# Altium schematic sheet Bluepill.SchDoc
size A4; SheetNumber: 3; SheetTotal: 7
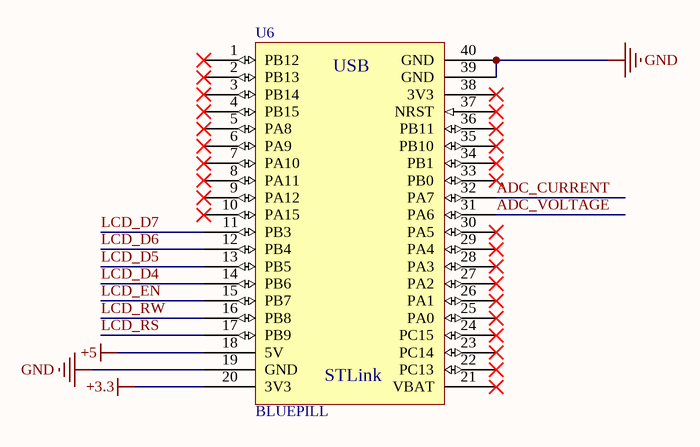
[diagram p0: Bluepill.SchDoc]

## Parts
U6  BLUEPILL  [BLUEPILL]

## Nets
+3.3: U6.20(3V3)
+5: U6.18(5V)
GND: U6.19(GND) U6.39(GND) U6.40(GND)
ADC_CURRENT: U6.32(PA7)
ADC_VOLTAGE: U6.31(PA6)
LCD_D4: U6.14(PB6)
LCD_D5: U6.13(PB5)
LCD_D6: U6.12(PB4)
LCD_D7: U6.11(PB3)
LCD_EN: U6.15(PB7)
LCD_RS: U6.17(PB9)
LCD_RW: U6.16(PB8)

Not connected (* = marked no-connect by the designer): U6 1(PB12)* 2(PB13)* 3(PB14)* 4(PB15)* 5(PA8)* 6(PA9)* 7(PA10)* 8(PA11)* 9(PA12)* 10(PA15)* 21(VBAT)* 22(PC13)* 23(PC14)* 24(PC15)* 25(PA0)* 26(PA1)* 27(PA2)* 28(PA3)* 29(PA4)* 30(PA5)* 33(PB0)* 34(PB1)* 35(PB10)* 36(PB11)* 37(NRST)* 38(3V3)*

## Notes on the sheet
- (in symbol BLUEPILL) USB; STLink

## Library data of the parts
U6 = BLUEPILL: Development board STM32F103C8T6